# EAGLE design untitled5 (EAGLE 9.5.2)
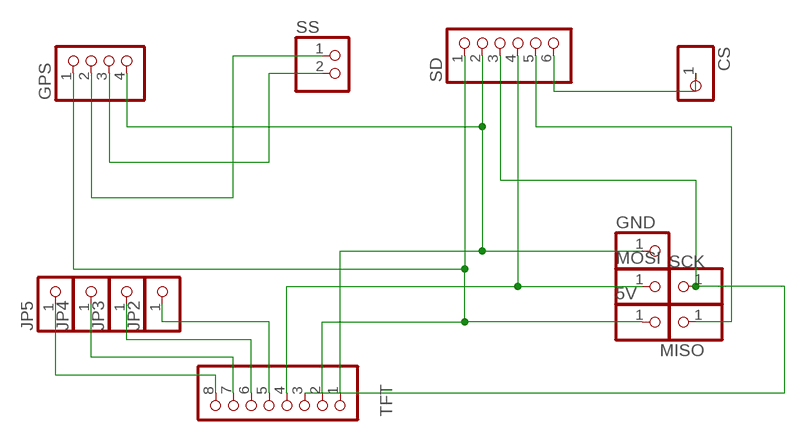
[diagram p0: schematic, sheet 1]

## Parts
5V  PINHD-1X1  [1X01]
CS  PINHD-1X1  [1X01]
GND  PINHD-1X1  [1X01]
GPS  PINHD-1X4  [1X04]
JP2  PINHD-1X1  [1X01]
JP3  PINHD-1X1  [1X01]
JP4  PINHD-1X1  [1X01]
JP5  PINHD-1X1  [1X01]
MISO  PINHD-1X1  [1X01]
MOSI  PINHD-1X1  [1X01]
SCK  PINHD-1X1  [1X01]
SD  PINHD-1X6  [1X06]
SS  PINHD-1X2  [1X02]
TFT  PINHD-1X8  [1X08]

## Nets
MOSI: MOSI.1 SD.4 TFT.4
N$1: CS.1 SD.6
N$2: MISO.1 SD.5
N$3: JP2.1 TFT.5
N$4: SCK.1 SD.3 TFT.3
N$5: GND.1 GPS.4 SD.2 TFT.1
N$6: JP3.1 TFT.6
N$7: GPS.2 SS.1
N$8: GPS.3 SS.2
N$9: JP4.1 TFT.7
N$10: JP5.1 TFT.8
S: 5V.1 GPS.1 SD.1 TFT.2

## Library data of the parts
5V CS GND JP2-JP5 MISO MOSI SCK = pinhead:PINHD-1X1: PIN HEADER
GPS = pinhead:PINHD-1X4: PIN HEADER
SD = pinhead:PINHD-1X6: PIN HEADER
SS = pinhead:PINHD-1X2: PIN HEADER
TFT = pinhead:PINHD-1X8: PIN HEADER

## Board
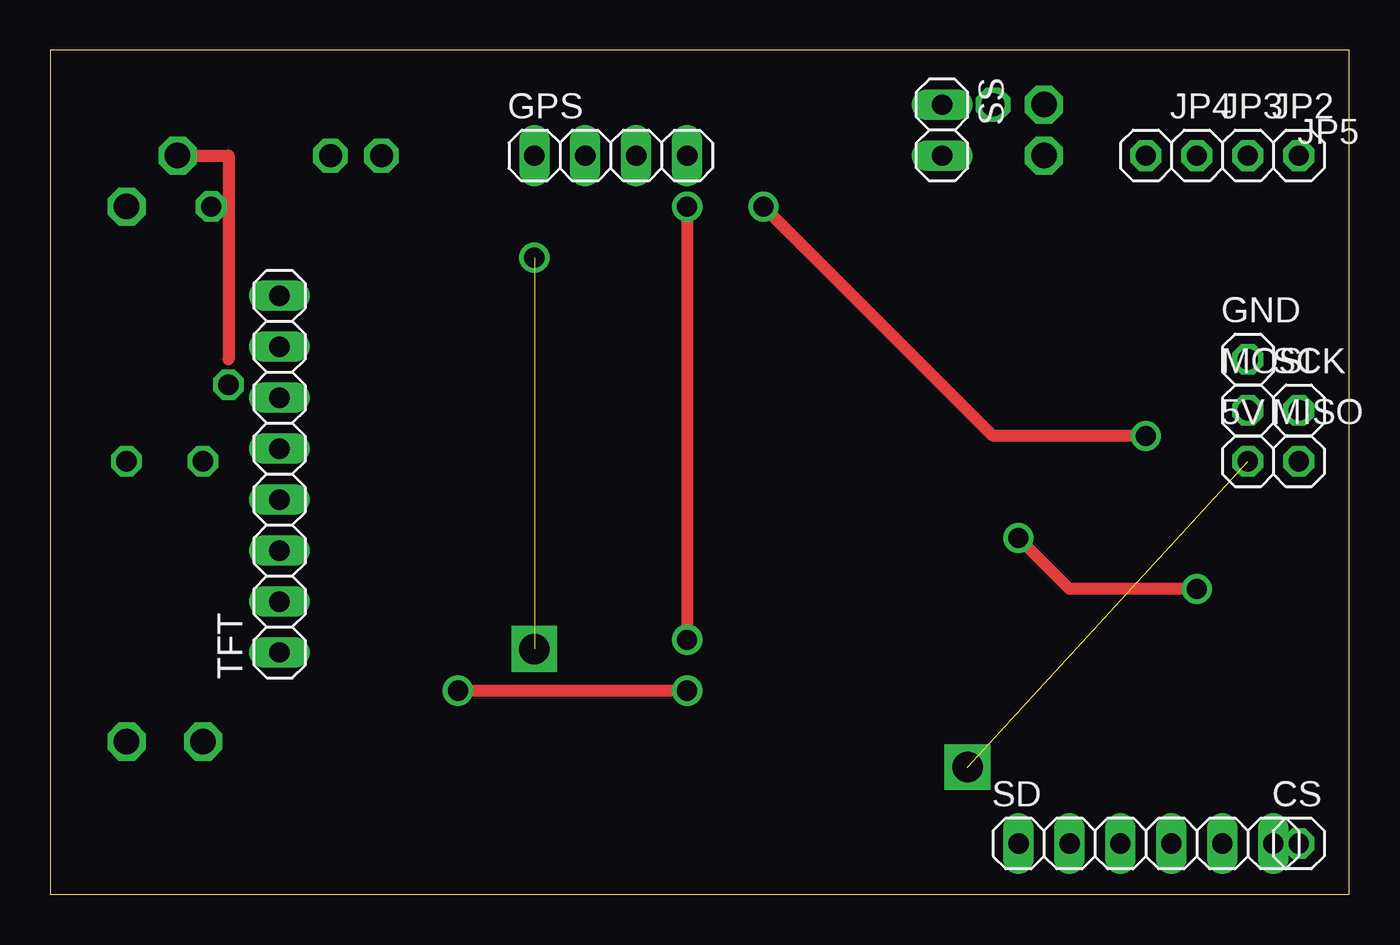
[diagram p1: board, top side]
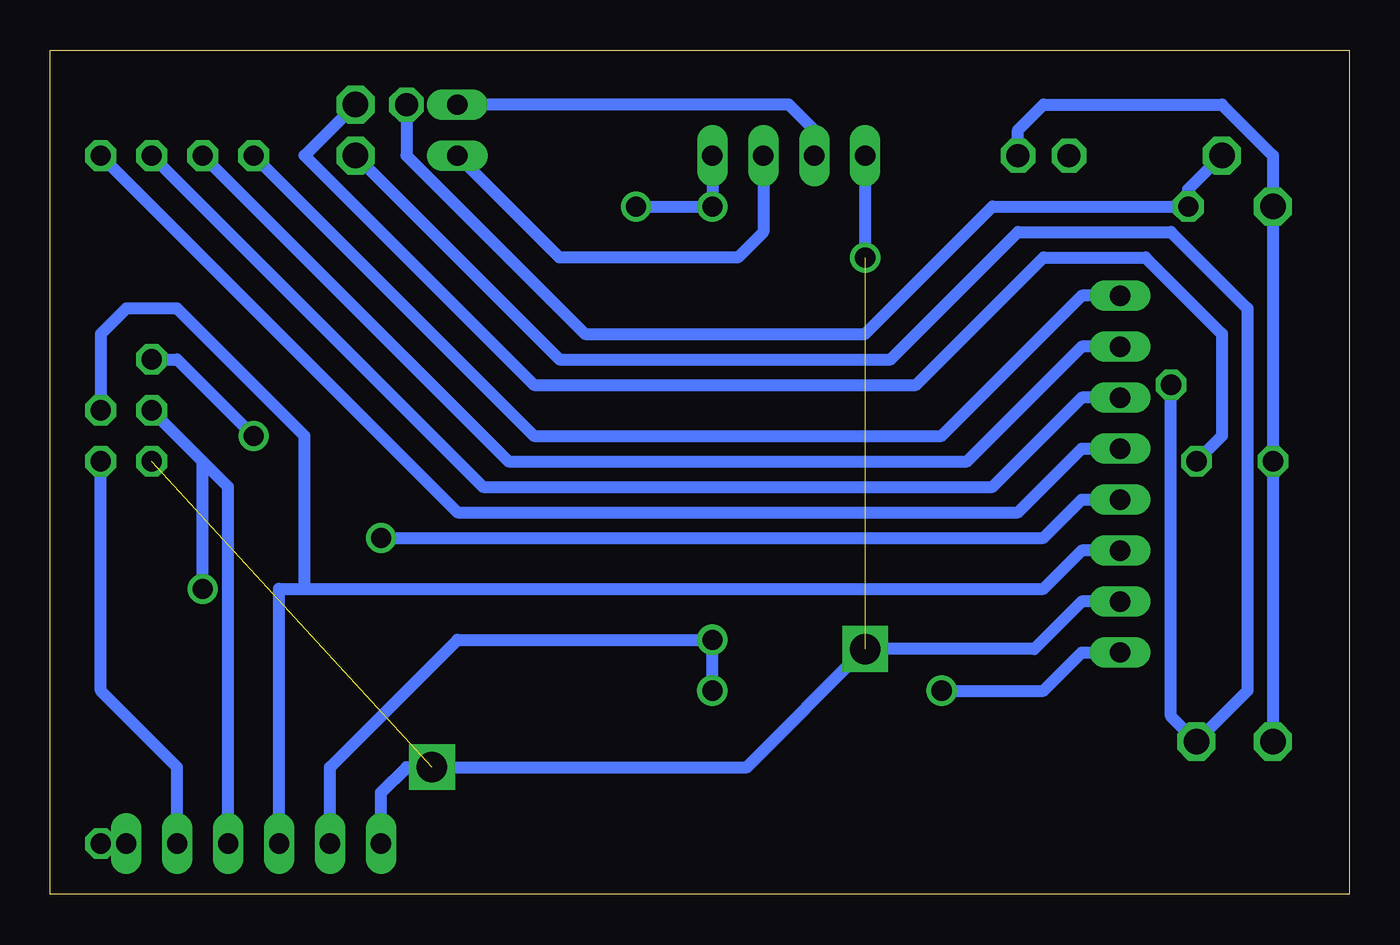
[diagram p2: board, bottom side, seen from below]

Size 64.75 x 42.09 mm. Coordinates in mm from the lower left corner, seen from the top.
Outline: 0,0 64.75,0 64.75,42.09 0,42.09 0,0
Copper layers (1*16): Top 0.035mm / dielectric 1.5mm / Bottom 0.035mm
Design rules "default": minimum track width 6mil, minimum drill 0.35mm, track to track 6mil, track to pad 6mil, pad to pad 6mil, via to via 6mil, smd to smd 6mil, copper to edge 40mil, drill to drill 6mil, minimum pad ring 10mil, minimum via ring 8mil, stop-mask expansion 4mil, vias tented up to drill 0mil, thermal gap 10mil

### Footprints (pad centres in the part's own frame; a part is rotated, then mirrored left to right if it is on the bottom)
1X01 = drill 1.016 octagon: 1 0,0
1X04 = drill 1.016 long: 1 -3.81,0; 2 -1.27,0; 3 1.27,0; 4 3.81,0
1X06 = drill 1.016 long: 1 -6.35,0; 2 -3.81,0; 3 -1.27,0; 4 1.27,0; 5 3.81,0; 6 6.35,0
1X02 = drill 1.016 long: 1 -1.27,0; 2 1.27,0
1X08 = drill 1.016 long: 1 -8.89,0; 2 -6.35,0; 3 -3.81,0; 4 -1.27,0; 5 1.27,0; 6 3.81,0; 7 6.35,0; 8 8.89,0

### Placement (x,y rotation side)
5V  59.69,21.59 0 top
CS  62.23,2.54 0 top
GND  59.69,26.67 0 top
GPS  27.94,36.83 0 top
JP2  62.23,36.83 0 top
JP3  59.69,36.83 0 top
JP4  57.15,36.83 0 top
JP5  54.61,36.83 0 top
MISO  62.23,21.59 0 top
MOSI  59.69,24.13 0 top
SCK  62.23,24.13 0 top
SD  54.61,2.54 0 top
SS  44.45,38.1 270 top
TFT  11.43,20.95 90 top

### Tracks (layer width: path | path; a pad name or v marks a point on that pad's centre or on a via)
MOSI  (via drill 1)
  Top 0.61: v48.26,17.78 50.8,15.24 v57.15,15.24
  Bottom 0.61: SD.4 55.88,20.32 57.15,21.59 | 57.15,21.59 MOSI.1 | v48.26,17.78 15.24,17.78 13.34,19.69 TFT.4 | v57.15,15.24 57.15,21.59
N$1
  Bottom 0.61: CS.1 SD.6
N$2
  Bottom 0.61: SD.5 58.42,6.35 62.23,10.16 MISO.1
N$3
  Bottom 0.61: JP2.1 44.45,19.05 16.51,19.05 13.34,22.23 TFT.5
N$4
  Bottom 0.61: SD.3 53.34,15.24 52.07,15.24 | 52.07,15.24 52.07,22.86 58.42,29.21 60.96,29.21 62.23,27.94 SCK.1 | 52.07,15.24 15.24,15.24 13.34,17.15 TFT.3
N$5  (via drill 1)
  Top 0.61: v31.75,10.16 v20.32,10.16 | v31.75,34.29 v31.75,12.7 | v54.61,22.86 46.99,22.86 v35.56,34.29
  Bottom 0.61: GND.1 58.42,26.67 v54.61,22.86 | GPS.4 v31.75,34.29 v35.56,34.29 | SD.2 50.8,6.35 44.45,12.7 v31.75,12.7 v31.75,10.16 | v20.32,10.16 15.24,10.16 13.34,12.07 TFT.1
N$6
  Bottom 0.61: JP3.1 43.18,20.32 17.78,20.32 13.34,24.77 TFT.6
N$7
  Bottom 0.61: SS.1 27.94,39.37 26.67,38.1 GPS.2
N$8
  Bottom 0.61: GPS.3 29.21,33.02 30.48,31.75 39.37,31.75 SS.2
N$9
  Bottom 0.61: JP4.1 41.91,21.59 19.05,21.59 13.34,27.31 TFT.7
N$10
  Bottom 0.61: TFT.8 13.34,29.84 20.32,22.86 40.64,22.86 JP5.1
N$11  (via drill 1.14 pad 0.95)
  other vias: 13.97,36.83
N$12  (via drill 1.02 pad 0.95, 1.14 pad 0.95, 1.27 pad 0.95)
  Bottom 0.61: v16.51,36.83 16.51,38.1 15.24,39.37 6.35,39.37 3.81,36.83 v3.81,34.29 v3.81,21.59 v3.81,7.62
N$13  (via drill 1.02 pad 0.95, 1.27 pad 0.95, 1.27 pad 1.27)
  Bottom 0.61: v49.53,36.83 39.37,26.67 22.86,26.67 16.51,33.02 8.89,33.02 5.08,29.21 5.08,10.16 v7.62,7.62 8.89,8.89 v8.89,25.4
N$14  (via drill 1.02 pad 0.95, 1.27 pad 0.95)
  Bottom 0.61: v49.53,39.37 52.07,36.83 40.64,25.4 21.59,25.4 15.24,31.75 10.16,31.75 6.35,27.94 6.35,22.86 v7.62,21.59
N$15  (via drill 1.02 pad 0.95, 1.14 pad 0.95, 1.27 pad 0.95)
  Top 0.61: v6.35,36.83 8.89,36.83 8.89,26.67
  Bottom 0.61: v46.99,39.37 46.99,36.83 38.1,27.94 24.13,27.94 17.78,34.29 v8.03,34.29 8.03,35.15 v6.35,36.83
S  (via drill 1, 1.52)  (2 unrouted)
  Bottom 0.61: GPS.1 v24.13,31.75 | SD.1 48.26,5.08 46.99,6.35 v45.72,6.35 30.01,6.35 v24.13,12.23 15.71,12.23 13.34,14.61 TFT.2